# Altium project Sensor_board.PrjPcb
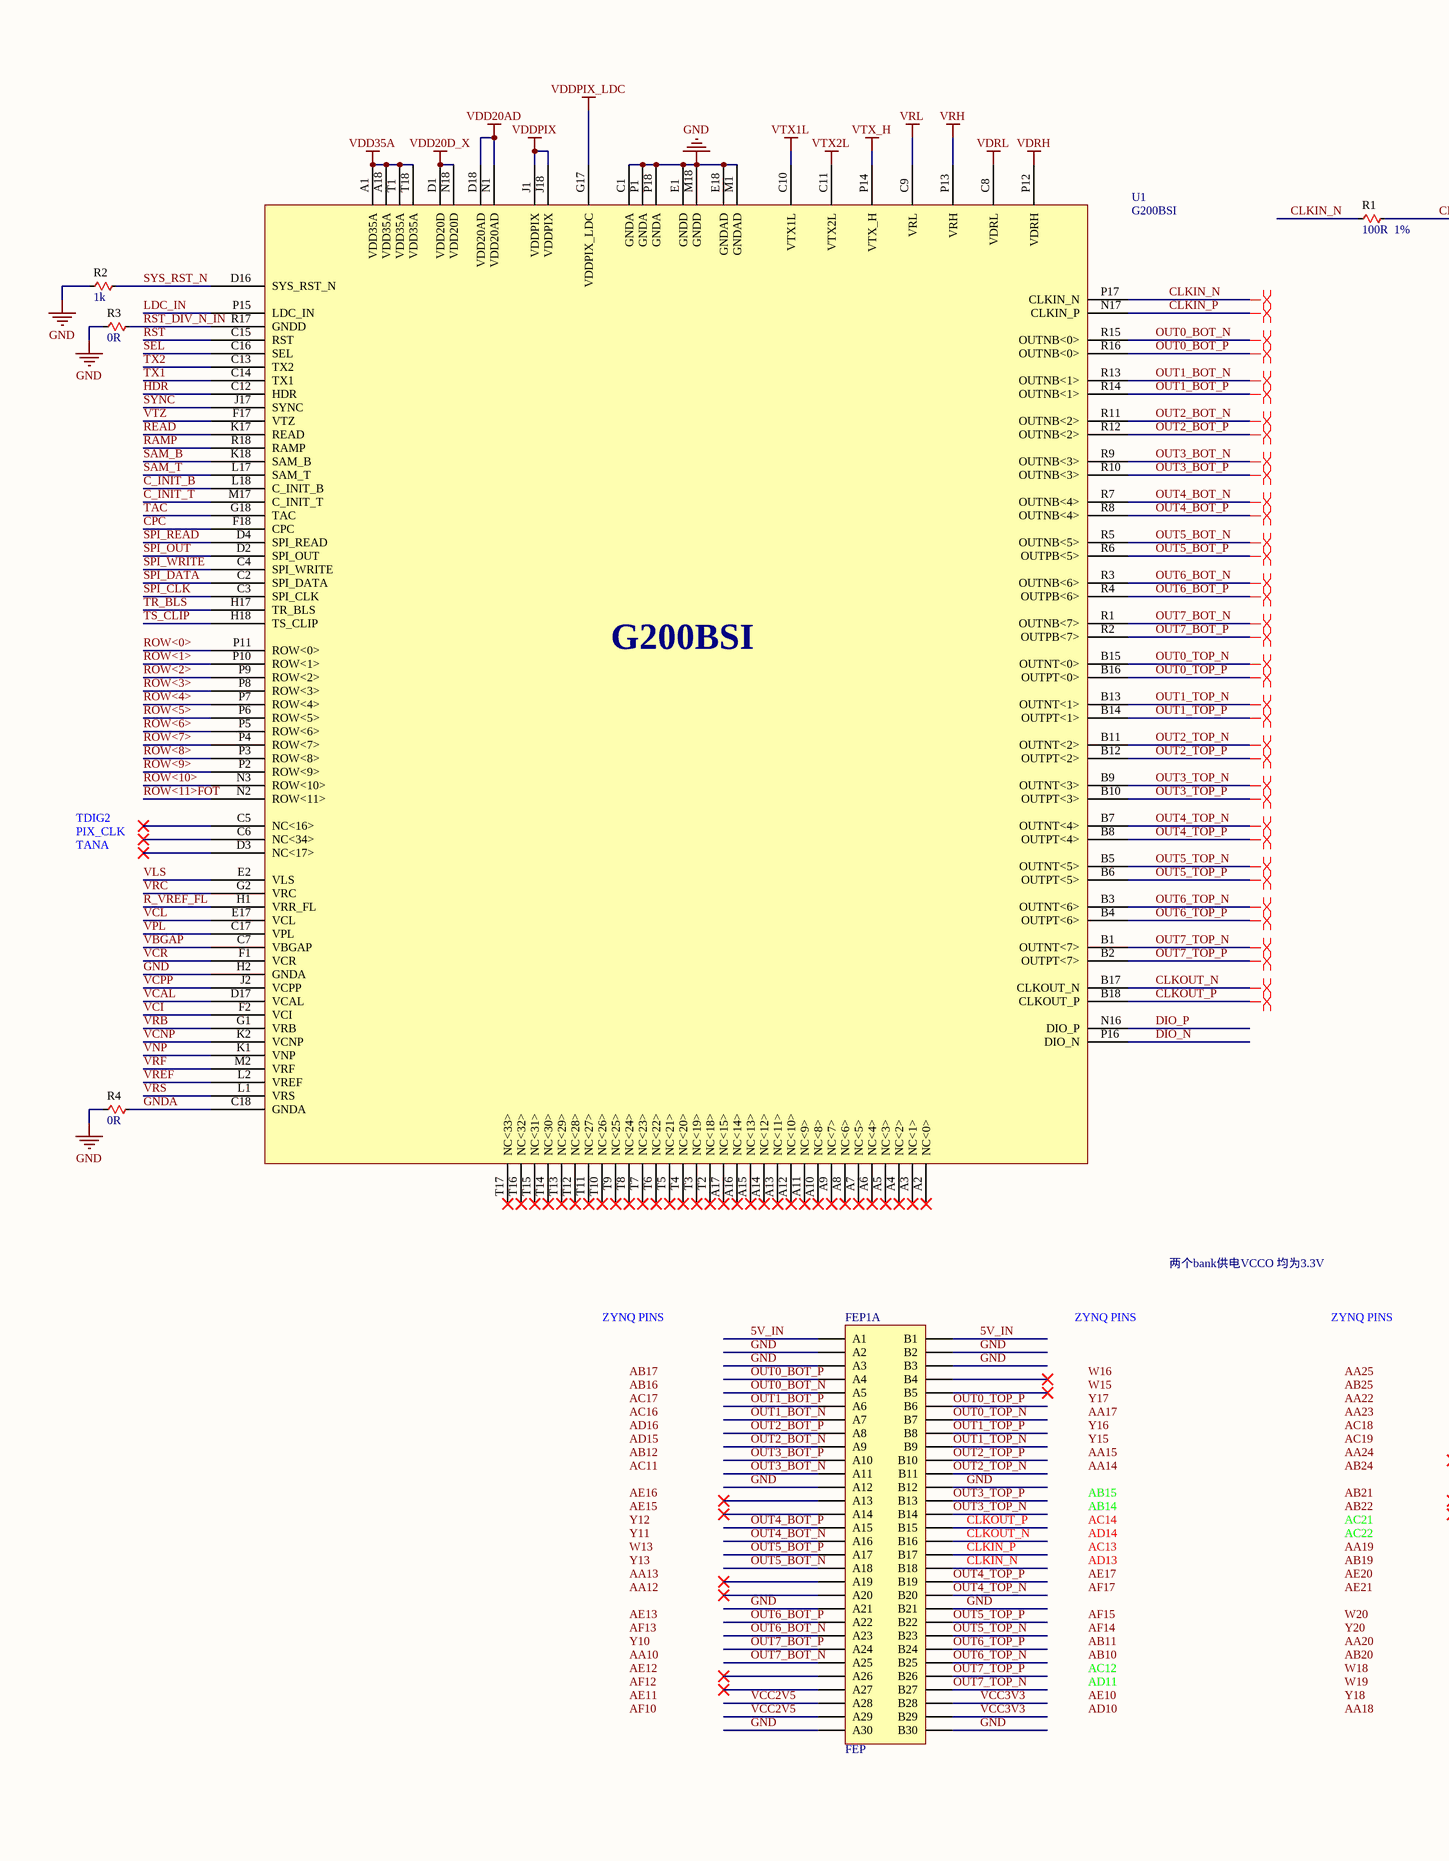
[diagram p0: Sensor.SchDoc, left]
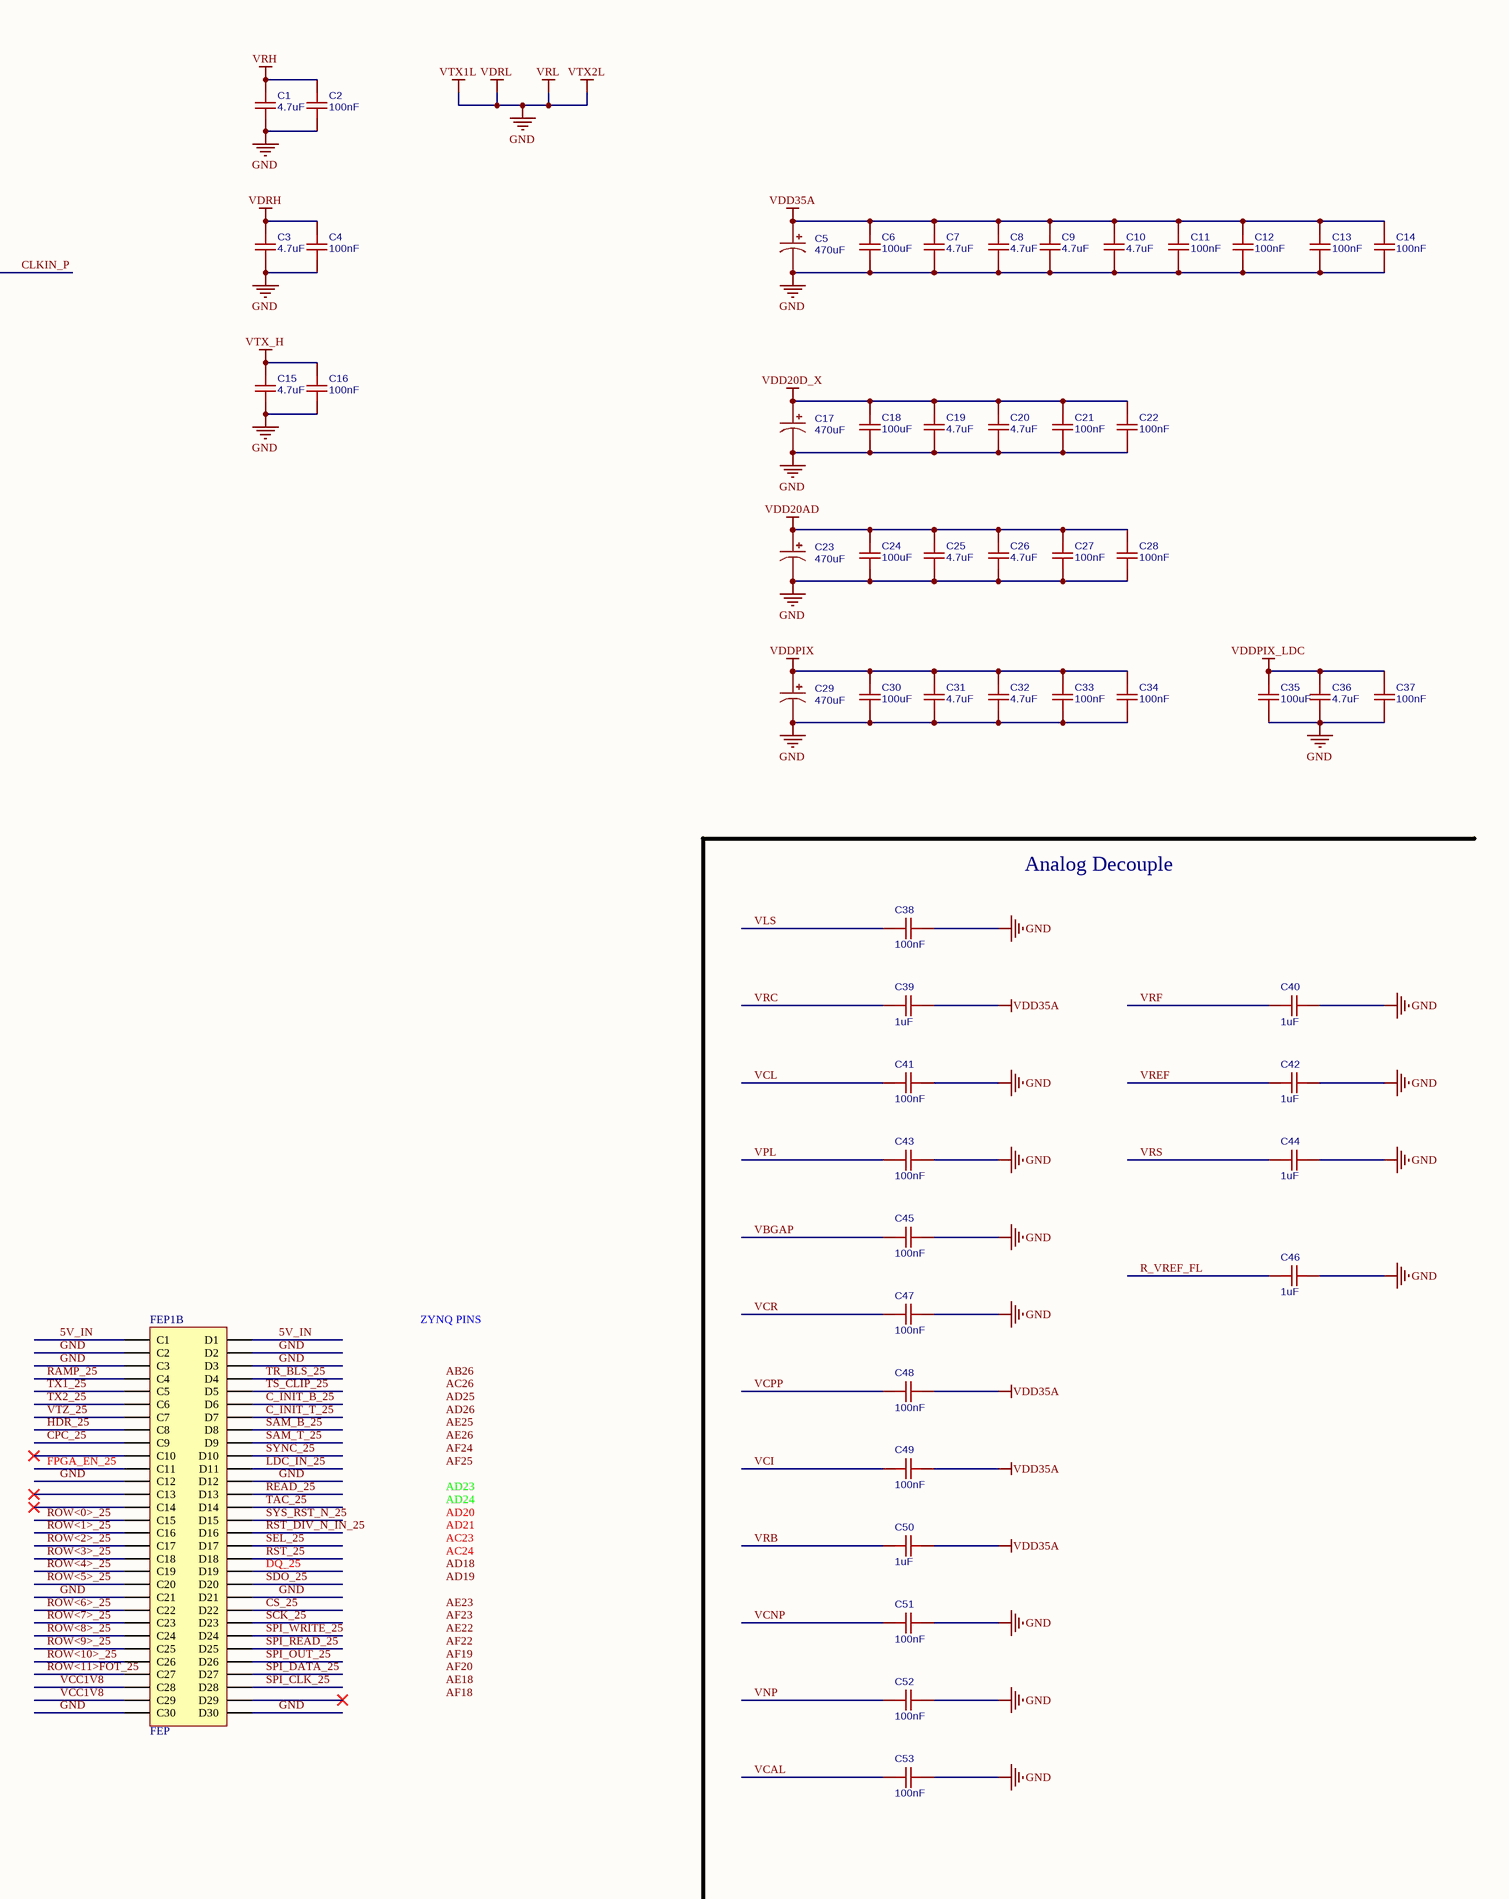
[diagram p1: Sensor.SchDoc, right]
2 sheets, 126 parts. Net scope: global (net labels, ports and power ports of the same name join across sheets).
Board file: sensor.PcbDoc
Sheets:
  Sensor.SchDoc
  Sensor_Power_Supply.SchDoc

## Sheet Sensor.SchDoc
size A2

### Parts
C1  4.7uF  [CAP0402]
C2  100nF  [CAP0402]
C3  4.7uF  [CAP0402]
C4  100nF  [CAP0402]
C5  470uF  [CASE-A_3216]
C6  100uF  [CAP0402]
C7  4.7uF  [CAP0402]
C8  4.7uF  [CAP0402]
C9  4.7uF  [CAP0402]
C10  4.7uF  [CAP0402]
C11  100nF  [CAP0402]
C12  100nF  [CAP0402]
C13  100nF  [CAP0402]
C14  100nF  [CAP0402]
C15  4.7uF  [CAP0402]
C16  100nF  [CAP0402]
C17  470uF  [CASE-A_3216]
C18  100uF  [CAP0402]
C19  4.7uF  [CAP0402]
C20  4.7uF  [CAP0402]
C21  100nF  [CAP0402]
C22  100nF  [CAP0402]
C23  470uF  [CASE-A_3216]
C24  100uF  [CAP0402]
C25  4.7uF  [CAP0402]
C26  4.7uF  [CAP0402]
C27  100nF  [CAP0402]
C28  100nF  [CAP0402]
C29  470uF  [CASE-A_3216]
C30  100uF  [CAP0402]
C31  4.7uF  [CAP0402]
C32  4.7uF  [CAP0402]
C33  100nF  [CAP0402]
C34  100nF  [CAP0402]
C35  100uF  [CAP0402]
C36  4.7uF  [CAP0402]
C37  100nF  [CAP0402]
C38  100nF  [CAP0402]
C39  1uF  [CAP0402]
C40  1uF  [CAP0402]
C41  100nF  [CAP0402]
C42  1uF  [CAP0402]
C43  100nF  [CAP0402]
C44  1uF  [CAP0402]
C45  100nF  [CAP0402]
C46  1uF  [CAP0402]
C47  100nF  [CAP0402]
C48  100nF  [CAP0402]
C49  100nF  [CAP0402]
C50  1uF  [CAP0402]
C51  100nF  [CAP0402]
C52  100nF  [CAP0402]
C53  100nF  [CAP0402]
FEP1  FEP  [FEP-X2]  (parts A,B of 3)
R1  100R  1%  [RES0402]
R2  1k  [RES0402]
R3  0R  [RES0402]
R4  0R  [RES0402]
U1  G200BSI  [ANDON Socket]

### Nets
5V_IN: FEP1.A1 FEP1.B1 FEP1.C1 FEP1.D1
GND: C1.1 C2.1 C3.1 C4.1 C5.2 C6.1 C7.1 C8.1 C9.1 C10.1 C11.1 C12.1 C13.1 C14.1 C15.1 C16.1 C17.2 C18.1 C19.1 C20.1 C21.1 C22.1 C23.2 C24.1 C25.1 C26.1 C27.1 C28.1 C29.2 C30.1 C31.1 C32.1 C33.1 C34.1 C35.1 C36.1 C37.1 C38.2 C40.2 C41.2 C42.2 C43.2 C44.2 C45.2 C46.2 C47.2 C51.2 C52.2 C53.2 FEP1.A2 FEP1.A3 FEP1.A12 FEP1.A21 FEP1.A30 FEP1.B2 FEP1.B3 FEP1.B12 FEP1.B21 FEP1.B30 FEP1.C2 FEP1.C3 FEP1.C12 FEP1.C21 FEP1.C30 FEP1.D2 FEP1.D3 FEP1.D12 FEP1.D21 FEP1.D30 R2.2 R3.2 R4.2 U1.C1(GNDA) U1.C8(VDRL) U1.C9(VRL) U1.C10(VTX1L) U1.C11(VTX2L) U1.E1(GNDD) U1.E18(GNDAD) U1.H2(GNDA) U1.M1(GNDAD) U1.M18(GNDD) U1.P1(GNDA) U1.P18(GNDA)  [also labelled VDRL, VRL, VTX1L, VTX2L]
VCC2V5: FEP1.A28 FEP1.A29
VCC3V3: FEP1.B28 FEP1.B29
VDD20AD: C17.1 C18.2 C19.2 C20.2 C21.2 C22.2 C23.1 C24.2 C25.2 C26.2 C27.2 C28.2 U1.D1(VDD20D) U1.D18(VDD20AD) U1.N1(VDD20AD) U1.N18(VDD20D)  [also labelled VDD20D_X]
VDD35A: C5.1 C6.2 C7.2 C8.2 C9.2 C10.2 C11.2 C12.2 C13.2 C14.2 C29.1 C30.2 C31.2 C32.2 C33.2 C34.2 C39.2 C48.2 C49.2 C50.2 U1.A1(VDD35A) U1.A18(VDD35A) U1.J1(VDDPIX) U1.J18(VDDPIX) U1.T1(VDD35A) U1.T18(VDD35A)  [also labelled VDDPIX]
VDDPIX_LDC: C35.2 C36.2 C37.2 U1.G17(VDDPIX_LDC)
VDRH: C1.2 C2.2 C3.2 C4.2 C15.2 C16.2 U1.P12(VDRH) U1.P13(VRH) U1.P14(VTX_H)  [also labelled VRH, VTX_H]
C_INIT_B: U1.L18(C_INIT_B)
C_INIT_B_25: FEP1.D6
C_INIT_T: U1.M17(C_INIT_T)
C_INIT_T_25: FEP1.D7
CLKIN_N: FEP1.B18 R1.2 U1.P17(CLKIN_N)
CLKIN_P: FEP1.B17 R1.1 U1.N17(CLKIN_P)
CLKOUT_N: FEP1.B16 U1.B17(CLKOUT_N)
CLKOUT_P: FEP1.B15 U1.B18(CLKOUT_P)
CPC: U1.F18(CPC)
CPC_25: FEP1.C9
CS_25: FEP1.D22
DIO_N: U1.P16(DIO_N)
DIO_P: U1.N16(DIO_P)
DQ_25: FEP1.D19
FPGA_EN_25: FEP1.C11
GNDA: R4.1 U1.C18(GNDA)
HDR: U1.C12(HDR)
HDR_25: FEP1.C8
LDC_IN: U1.P15(LDC_IN)
LDC_IN_25: FEP1.D11
OUT0_BOT_N: FEP1.A5 U1.R15(OUTNB<0>)
OUT0_BOT_P: FEP1.A4 U1.R16(OUTNB<0>)
OUT0_TOP_N: FEP1.B7 U1.B15(OUTNT<0>)
OUT0_TOP_P: FEP1.B6 U1.B16(OUTPT<0>)
OUT1_BOT_N: FEP1.A7 U1.R13(OUTNB<1>)
OUT1_BOT_P: FEP1.A6 U1.R14(OUTNB<1>)
OUT1_TOP_N: FEP1.B9 U1.B13(OUTNT<1>)
OUT1_TOP_P: FEP1.B8 U1.B14(OUTPT<1>)
OUT2_BOT_N: FEP1.A9 U1.R11(OUTNB<2>)
OUT2_BOT_P: FEP1.A8 U1.R12(OUTNB<2>)
OUT2_TOP_N: FEP1.B11 U1.B11(OUTNT<2>)
OUT2_TOP_P: FEP1.B10 U1.B12(OUTPT<2>)
OUT3_BOT_N: FEP1.A11 U1.R9(OUTNB<3>)
OUT3_BOT_P: FEP1.A10 U1.R10(OUTNB<3>)
OUT3_TOP_N: FEP1.B14 U1.B9(OUTNT<3>)
OUT3_TOP_P: FEP1.B13 U1.B10(OUTPT<3>)
OUT4_BOT_N: FEP1.A16 U1.R7(OUTNB<4>)
OUT4_BOT_P: FEP1.A15 U1.R8(OUTNB<4>)
OUT4_TOP_N: FEP1.B20 U1.B7(OUTNT<4>)
OUT4_TOP_P: FEP1.B19 U1.B8(OUTPT<4>)
OUT5_BOT_N: FEP1.A18 U1.R5(OUTNB<5>)
OUT5_BOT_P: FEP1.A17 U1.R6(OUTPB<5>)
OUT5_TOP_N: FEP1.B23 U1.B5(OUTNT<5>)
OUT5_TOP_P: FEP1.B22 U1.B6(OUTPT<5>)
OUT6_BOT_N: FEP1.A23 U1.R3(OUTNB<6>)
OUT6_BOT_P: FEP1.A22 U1.R4(OUTPB<6>)
OUT6_TOP_N: FEP1.B25 U1.B3(OUTNT<6>)
OUT6_TOP_P: FEP1.B24 U1.B4(OUTPT<6>)
OUT7_BOT_N: FEP1.A25 U1.R1(OUTNB<7>)
OUT7_BOT_P: FEP1.A24 U1.R2(OUTPB<7>)
OUT7_TOP_N: FEP1.B27 U1.B1(OUTNT<7>)
OUT7_TOP_P: FEP1.B26 U1.B2(OUTPT<7>)
R_VREF_FL: C46.1 U1.H1(VRR_FL)
RAMP: U1.R18(RAMP)
RAMP_25: FEP1.C4
READ: U1.K17(READ)
READ_25: FEP1.D13
ROW<0>: U1.P11(ROW<0>)
ROW<0>_25: FEP1.C15
ROW<1>: U1.P10(ROW<1>)
ROW<1>_25: FEP1.C16
ROW<2>: U1.P9(ROW<2>)
ROW<2>_25: FEP1.C17
ROW<3>: U1.P8(ROW<3>)
ROW<3>_25: FEP1.C18
ROW<4>: U1.P7(ROW<4>)
ROW<4>_25: FEP1.C19
ROW<5>: U1.P6(ROW<5>)
ROW<5>_25: FEP1.C20
ROW<6>: U1.P5(ROW<6>)
ROW<6>_25: FEP1.C22
ROW<7>: U1.P4(ROW<7>)
ROW<7>_25: FEP1.C23
ROW<8>: U1.P3(ROW<8>)
ROW<8>_25: FEP1.C24
ROW<9>: U1.P2(ROW<9>)
ROW<9>_25: FEP1.C25
ROW<10>: U1.N3(ROW<10>)
ROW<10>_25: FEP1.C26
ROW<11>FOT: U1.N2(ROW<11>)
ROW<11>FOT_25: FEP1.C27
RST: U1.C15(RST)
RST_25: FEP1.D18
RST_DIV_N_IN: R3.1 U1.R17(GNDD)
RST_DIV_N_IN_25: FEP1.D16
SAM_B: U1.K18(SAM_B)
SAM_B_25: FEP1.D8
SAM_T: U1.L17(SAM_T)
SAM_T_25: FEP1.D9
SCK_25: FEP1.D23
SDO_25: FEP1.D20
SEL: U1.C16(SEL)
SEL_25: FEP1.D17
SPI_CLK: U1.C3(SPI_CLK)
SPI_CLK_25: FEP1.D28
SPI_DATA: U1.C2(SPI_DATA)
SPI_DATA_25: FEP1.D27
SPI_OUT: U1.D2(SPI_OUT)
SPI_OUT_25: FEP1.D26
SPI_READ: U1.D4(SPI_READ)
SPI_READ_25: FEP1.D25
SPI_WRITE: U1.C4(SPI_WRITE)
SPI_WRITE_25: FEP1.D24
SYNC: U1.J17(SYNC)
SYNC_25: FEP1.D10
SYS_RST_N: R2.1 U1.D16(SYS_RST_N)
SYS_RST_N_25: FEP1.D15
TAC: U1.G18(TAC)
TAC_25: FEP1.D14
TR_BLS: U1.H17(TR_BLS)
TR_BLS_25: FEP1.D4
TS_CLIP: U1.H18(TS_CLIP)
TS_CLIP_25: FEP1.D5
TX1: U1.C14(TX1)
TX1_25: FEP1.C5
TX2: U1.C13(TX2)
TX2_25: FEP1.C6
VBGAP: C45.1 U1.C7(VBGAP)
VCAL: C53.1 U1.D17(VCAL)
VCC1V8: FEP1.C28 FEP1.C29
VCI: C49.1 U1.F2(VCI)
VCL: C41.1 U1.E17(VCL)
VCNP: C51.1 U1.K2(VCNP)
VCPP: C48.1 U1.J2(VCPP)
VCR: C47.1 U1.F1(VCR)
VLS: C38.1 U1.E2(VLS)
VNP: C52.1 U1.K1(VNP)
VPL: C43.1 U1.C17(VPL)
VRB: C50.1 U1.G1(VRB)
VRC: C39.1 U1.G2(VRC)
VREF: C42.1 U1.L2(VREF)
VRF: C40.1 U1.M2(VRF)
VRS: C44.1 U1.L1(VRS)
VTZ: U1.F17(VTZ)
VTZ_25: FEP1.C7

Not connected (* = marked no-connect by the designer): FEP1 A13* A14* A19* A20* A26* A27* B4* B5* C10* C13* C14* D29*; U1 A2(NC<0>)* A3(NC<1>)* A4(NC<2>)* A5(NC<3>)* A6(NC<4>)* A7(NC<5>)* A8(NC<6>)* A9(NC<7>)* A10(NC<8>)* A11(NC<9>)* A12(NC<10>)* A13(NC<11>)* A14(NC<12>)* A15(NC<13>)* A16(NC<14>)* A17(NC<15>)* C5(NC<16>)* C6(NC<34>)* D3(NC<17>)* T2(NC<18>)* T3(NC<19>)* T4(NC<20>)* T5(NC<21>)* T6(NC<22>)* T7(NC<23>)* T8(NC<24>)* T9(NC<25>)* T10(NC<26>)* T11(NC<27>)* T12(NC<28>)* T13(NC<29>)* T14(NC<30>)* T15(NC<31>)* T16(NC<32>)* T17(NC<33>)*

### Layout directives
differential pair: CLKIN_N, CLKIN_P, CLKOUT_N, CLKOUT_P, OUT0_BOT_N, OUT0_BOT_P, OUT0_TOP_N, OUT0_TOP_P, OUT1_BOT_N, OUT1_BOT_P, OUT1_TOP_N, OUT1_TOP_P, OUT2_BOT_N, OUT2_BOT_P, OUT2_TOP_N, OUT2_TOP_P, OUT3_BOT_N, OUT3_BOT_P, OUT3_TOP_N, OUT3_TOP_P, OUT4_BOT_N, OUT4_BOT_P, OUT4_TOP_N, OUT4_TOP_P, OUT5_BOT_N, OUT5_BOT_P, OUT5_TOP_N, OUT5_TOP_P, OUT6_BOT_N, OUT6_BOT_P, OUT6_TOP_N, OUT6_TOP_P, OUT7_BOT_N, OUT7_BOT_P, OUT7_TOP_N, OUT7_TOP_P

### Notes on the sheet
- Analog Decouple
- 两个bank供电VCCO 均为3.3V
- Labels drawn without touching a wire or pin: AA10, AA12, AA13, AA14, AA15, AA17, AA18, AA19, AA20, AA22, AA23, AA24, AA25, AB10, AB11, AB12, AB14, AB15, AB16, AB17, AB19, AB20, AB21, AB22, AB24, AB25, AB26, AC11, AC12, AC13, AC14, AC16, AC17, AC18, AC19, AC21, AC22, AC23, AC24, AC26, AD10, AD11, AD13, AD14, AD15, AD16, AD18, AD19, AD20, AD21, AD23, AD24, AD25, AD26, AE10, AE11, AE12, AE13, AE15, AE16, AE17, AE18, AE20, AE21, AE22, AE23, AE25, AE26, AF10, AF12, AF13, AF14, AF15, AF17, AF18, AF19, AF20, AF22, AF23, AF24, AF25, PIX_CLK, TANA, TDIG2, W13, W15, W16, W18, W19, W20, Y10, Y11, Y12, Y13, Y15, Y16, Y17, Y18, Y20, ZYNQ PINS

### Library data of the parts
C1 C3 C7-C10 C15 C19 C20 C25 C26 C31 C32 C36 = 4.7u: nameAlias: Value(F); Contributor: LCEDA_Lib; spicePre: C; spiceSymbolName: C_0603_US
C2 C4 C6 C11-C14 C16 C18 C21 C22 C24 C27 C28 C30 C33-C35 C37 C38 C41 C43 C45 C47-C49 C51-C53 = 100n: nameAlias: Value(F); Contributor: LCEDA_Lib; spicePre: C; spiceSymbolName: C_0603_US
C5 C17 C23 C29 = 150u: nameAlias: Value(F); Contributor: LCEDA_Lib; spicePre: C; spiceSymbolName: C_Tan_SMD_A_US
C39 C40 C42 C44 C46 C50 = 1u: nameAlias: Value(F); Contributor: LCEDA_Lib; spicePre: C; spiceSymbolName: C_0603_US
FEP1 = FEP-2X
R1-R4 = RESISTOR: Generic Resistor; Value: 10K; Manufacturer: *; DPN: *

## Sheet Sensor_Power_Supply.SchDoc
size A3
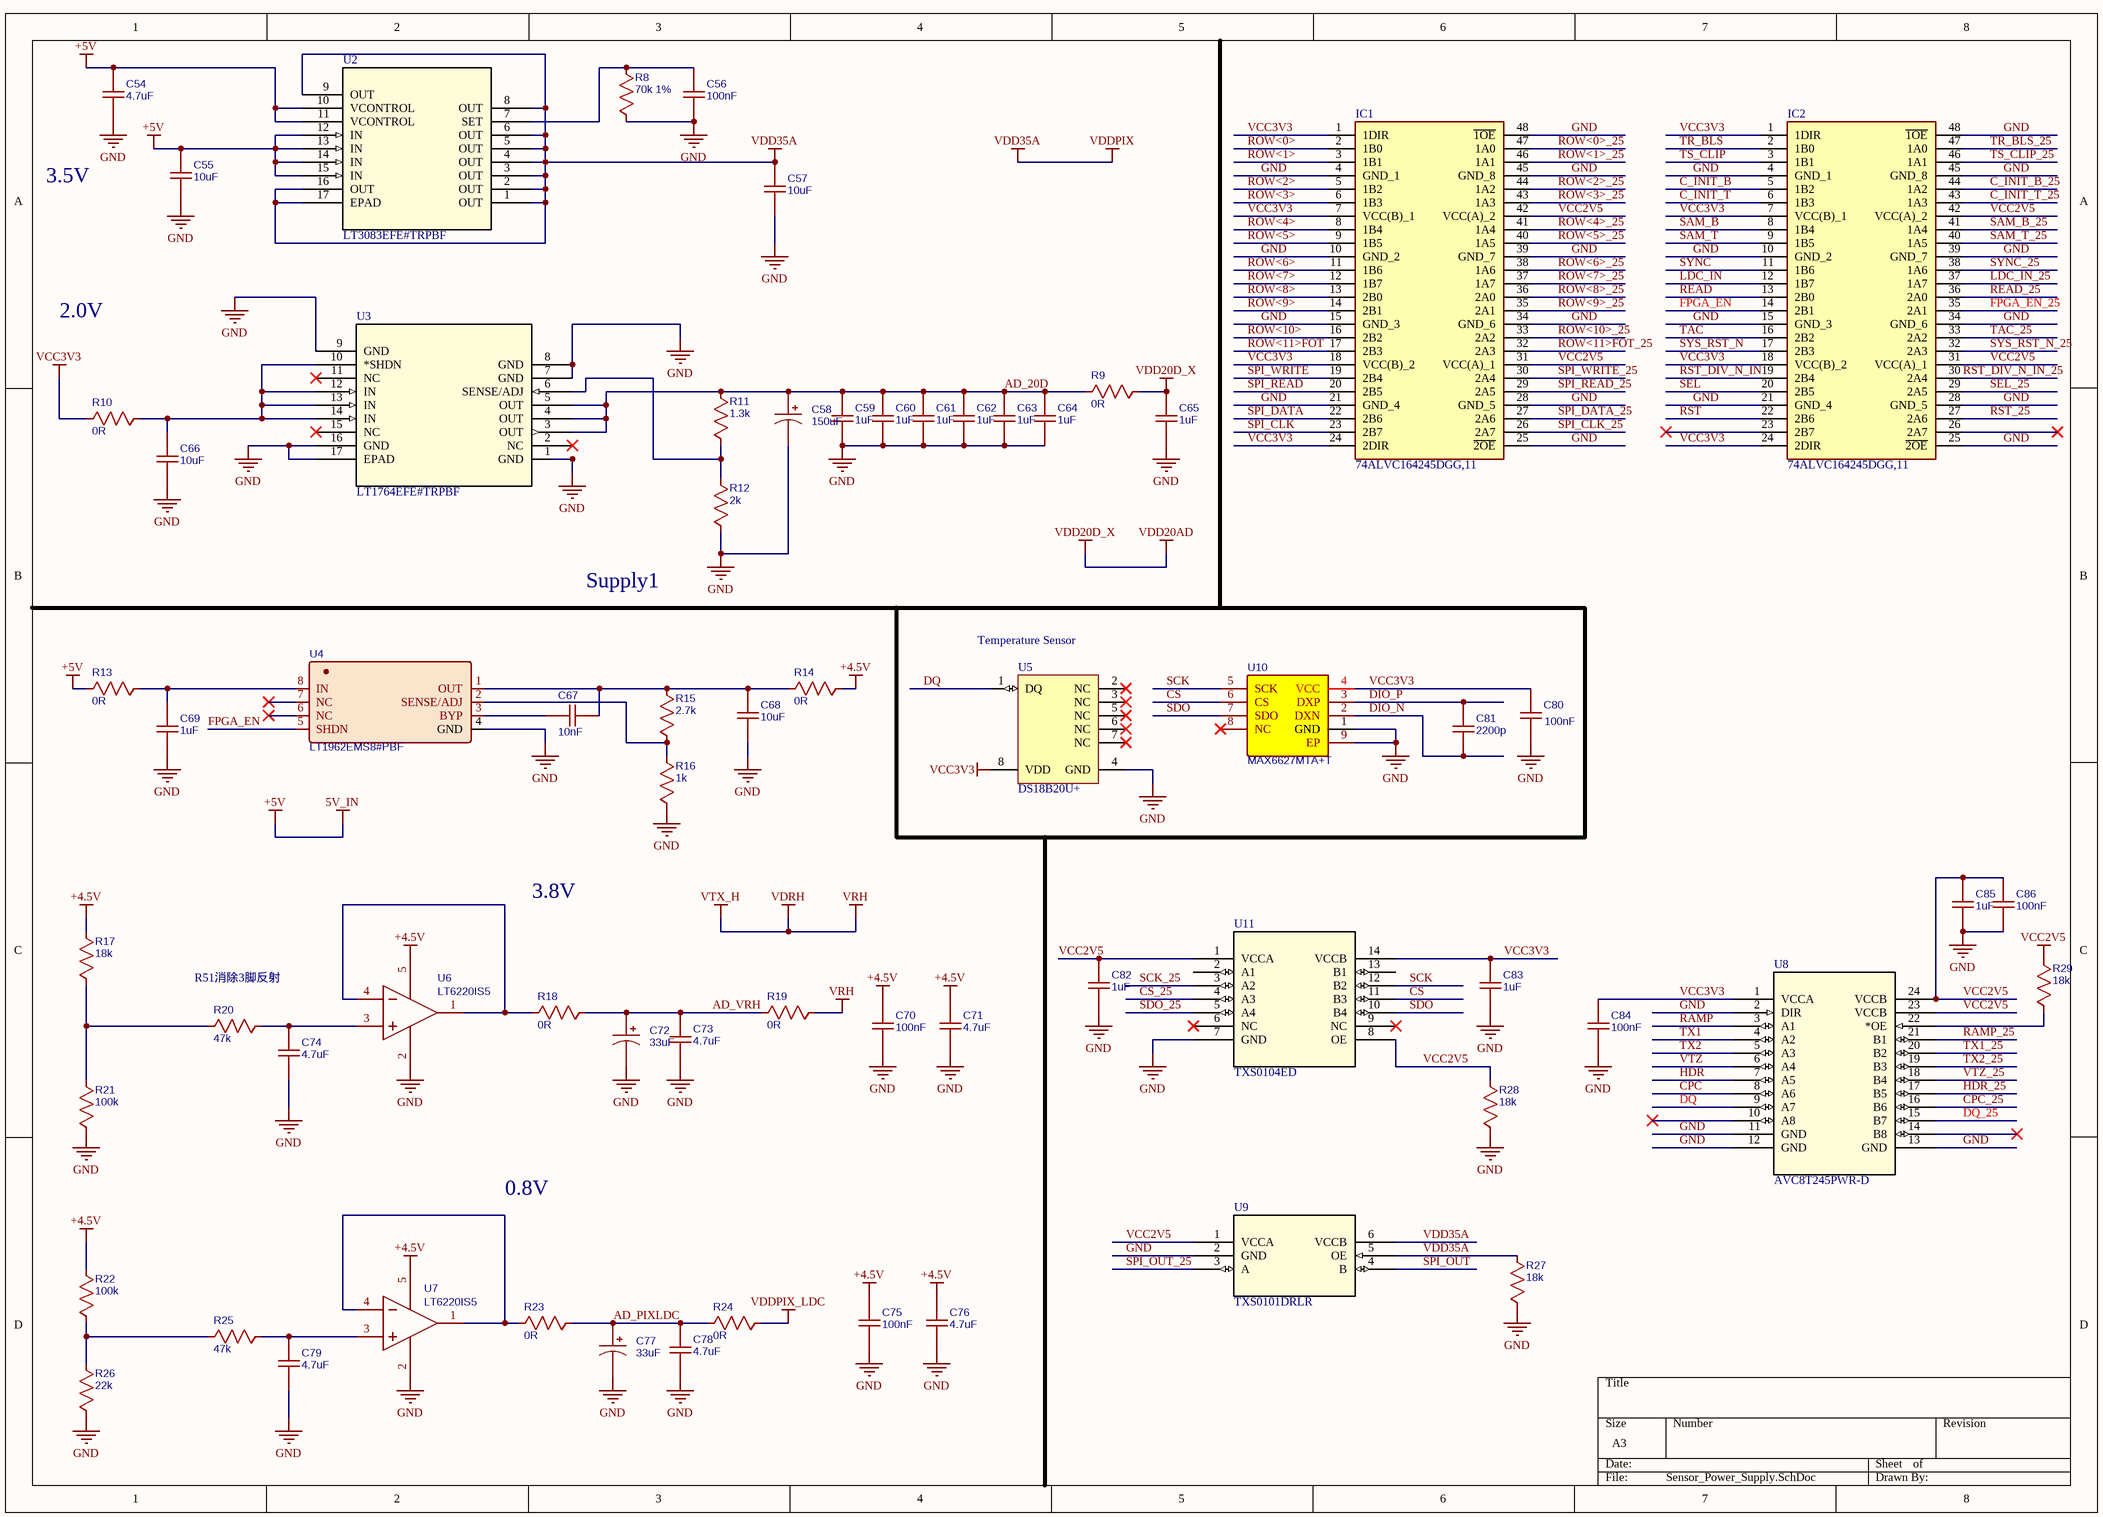
[diagram p2: Sensor_Power_Supply.SchDoc]

### Parts
C54  4.7uF  [C0603]
C55  10uF  [C0603]
C56  100nF  [C0603]
C57  10uF  [CAP0402]
C58  150uF  [CASE-A_3216]
C59  1uF  [C0603]
C60  1uF  [C0603]
C61  1uF  [C0603]
C62  1uF  [C0603]
C63  1uF  [C0603]
C64  1uF  [C0603]
C65  1uF  [C0603]
C66  10uF  [C0603]
C67  10nF  [CAP0402]
C68  10uF  [C0603]
C69  1uF  [C0603]
C70  100nF  [C0603]
C71  4.7uF  [C0603]
C72  33uF  [CASE-A_3216]
C73  4.7uF  [C0603]
C74  4.7uF  [C0603]
C75  100nF  [C0603]
C76  4.7uF  [C0603]
C77  33uF  [CASE-A_3216]
C78  4.7uF  [C0603]
C79  4.7uF  [C0603]
C80  100nF  [C0603]
C81  2200p  [C0603]
C82  1uF  [CAP0402]
C83  1uF  [CAP0402]
C84  100nF  [CAP0402]
C85  1uF  [CAP0402]
C86  100nF  [CAP0402]
IC1  74ALVC164245DGG,11  [SOP50P810X120-48N]
IC2  74ALVC164245DGG,11  [SOP50P810X120-48N]
R8  70k 1%  [R0603]
R9  0R  [R0603]
R10  0R  [R0603]
R11  1.3k  [R0603]
R12  2k  [R0603]
R13  0R  [R0603]
R14  0R  [R0603]
R15  2.7k  [RES0402]
R16  1k  [RES0402]
R17  18k  [R0603]
R18  0R  [RES0402]
R19  0R  [R0603]
R20  47k  [R0603]
R21  100k  [R0603]
R22  100k  [R0603]
R23  0R  [RES0402]
R24  0R  [R0603]
R25  47k  [R0603]
R26  22k  [R0603]
R27  18k  [RES0402]
R28  18k  [R0603]
R29  18k  [RES0402]
U2  LT3083EFE#TRPBF  [TSSOP-16_FE/BB]
U3  LT1764EFE#TRPBF  [TSSOP-16_FE/BB]
U4  LT1962EMS8#PBF  [MSOP-8_L3.0-W3.0-P0.65-LS5.0-TL]
U5  DS18B20U+  [MAXM-U8+1_N]
U6  LT6220IS5  [SOT23-5]
U7  LT6220IS5  [SOT23-5]
U8  AVC8T245PWR-D  [PW24]
U9  TXS0101DRLR  [DRL6]
U10  MAX6627MTA+T  [MAXM-T833+2_V]
U11  TXS0104ED  [D14]

### Nets
5V_IN: C54.2 C55.2 R13.1 U2.10(VCONTROL) U2.11(VCONTROL) U2.12(IN) U2.13(IN) U2.14(IN) U2.15(IN)  [also labelled +5V]
+4.5V: C70.2 C71.2 C75.2 C76.2 R14.2 R17.2 R22.2 U6.5(VS+) U7.5(VS+)
GND: C54.1 C55.1 C56.1 C57.1 C58.2 C59.1 C60.1 C61.1 C62.1 C63.1 C64.1 C65.1 C66.1 C68.2 C69.1 C70.1 C71.1 C72.2 C73.1 C74.1 C75.1 C76.1 C77.2 C78.1 C79.1 C80.1 C82.1 C83.1 C84.1 C85.1 C86.1 IC1.4(GND_1) IC1.10(GND_2) IC1.15(GND_3) IC1.21(GND_4) IC1.25(~{2OE}) IC1.28(GND_5) IC1.34(GND_6) IC1.39(GND_7) IC1.45(GND_8) IC1.48(~{1OE}) IC2.4(GND_1) IC2.10(GND_2) IC2.15(GND_3) IC2.21(GND_4) IC2.25(~{2OE}) IC2.28(GND_5) IC2.34(GND_6) IC2.39(GND_7) IC2.45(GND_8) IC2.48(~{1OE}) R8.1 R12.1 R16.1 R21.1 R26.1 R27.1 R28.1 U3.1(GND) U3.7(GND) U3.8(GND) U3.9(GND) U3.16(GND) U3.17(EPAD) U4.4(GND) U5.4(GND) U6.2(VS-) U7.2(VS-) U8.2(DIR) U8.11(GND) U8.12(GND) U8.13(GND) U9.2(GND) U10.1(GND) U10.9(EP) U11.7(GND)
VCC2V5: C82.2 C85.2 C86.2 IC1.31(VCC(A)_1) IC1.42(VCC(A)_2) IC2.31(VCC(A)_1) IC2.42(VCC(A)_2) R28.2 R29.2 U8.23(VCCB) U8.24(VCCB) U9.1(VCCA) U11.1(VCCA) U11.8(OE)
VCC3V3: C80.2 C83.2 C84.2 IC1.1(1DIR) IC1.7(VCC(B)_1) IC1.18(VCC(B)_2) IC1.24(2DIR) IC2.1(1DIR) IC2.7(VCC(B)_1) IC2.18(VCC(B)_2) IC2.24(2DIR) R10.1 U5.8(VDD) U8.1(VCCA) U10.4(VCC) U11.14(VCCB)
VDD20AD: C65.2 R9.2  [also labelled VDD20D_X]
VDD35A: C57.2 R27.2 U2.1(OUT) U2.2(OUT) U2.3(OUT) U2.4(OUT) U2.5(OUT) U2.6(OUT) U2.8(OUT) U2.9(OUT) U2.16(OUT) U2.17(EPAD) U9.5(OE) U9.6(VCCB)  [also labelled VDDPIX]
VDDPIX_LDC: R24.2
VDRH: R19.2  [also labelled VRH, VTX_H]
AD_20D: C58.1 C59.2 C60.2 C61.2 C62.2 C63.2 C64.2 R9.1 R11.2 U3.3(OUT) U3.4(OUT) U3.5(OUT)
AD_PIXLDC: C77.1 C78.2 R23.2 R24.1
AD_VRH: C72.1 C73.2 R18.2 R19.1
C_INIT_B: IC2.5(1B2)
C_INIT_B_25: IC2.44(1A2)
C_INIT_T: IC2.6(1B3)
C_INIT_T_25: IC2.43(1A3)
CPC: U8.8(A6)
CPC_25: U8.16(B6)
CS: U10.6(CS) U11.11(B3)
CS_25: U11.4(A3)
DIO_N: C81.1 U10.2(DXN)
DIO_P: C81.2 U10.3(DXP)
DQ: U5.1(DQ) U8.9(A7)
DQ_25: U8.15(B7)
FPGA_EN: IC2.14(2B1) U4.5(SHDN)
FPGA_EN_25: IC2.35(2A1)
HDR: U8.7(A5)
HDR_25: U8.17(B5)
LDC_IN: IC2.12(1B7)
LDC_IN_25: IC2.37(1A7)
RAMP: U8.3(A1)
RAMP_25: U8.21(B1)
READ: IC2.13(2B0)
READ_25: IC2.36(2A0)
ROW<0>: IC1.2(1B0)
ROW<0>_25: IC1.47(1A0)
ROW<1>: IC1.3(1B1)
ROW<1>_25: IC1.46(1A1)
ROW<2>: IC1.5(1B2)
ROW<2>_25: IC1.44(1A2)
ROW<3>: IC1.6(1B3)
ROW<3>_25: IC1.43(1A3)
ROW<4>: IC1.8(1B4)
ROW<4>_25: IC1.41(1A4)
ROW<5>: IC1.9(1B5)
ROW<5>_25: IC1.40(1A5)
ROW<6>: IC1.11(1B6)
ROW<6>_25: IC1.38(1A6)
ROW<7>: IC1.12(1B7)
ROW<7>_25: IC1.37(1A7)
ROW<8>: IC1.13(2B0)
ROW<8>_25: IC1.36(2A0)
ROW<9>: IC1.14(2B1)
ROW<9>_25: IC1.35(2A1)
ROW<10>: IC1.16(2B2)
ROW<10>_25: IC1.33(2A2)
ROW<11>FOT: IC1.17(2B3)
ROW<11>FOT_25: IC1.32(2A3)
RST: IC2.22(2B6)
RST_25: IC2.27(2A6)
RST_DIV_N_IN: IC2.19(2B4)
RST_DIV_N_IN_25: IC2.30(2A4)
SAM_B: IC2.8(1B4)
SAM_B_25: IC2.41(1A4)
SAM_T: IC2.9(1B5)
SAM_T_25: IC2.40(1A5)
SCK: U10.5(SCK) U11.12(B2)
SCK_25: U11.3(A2)
SDO: U10.7(SDO) U11.10(B4)
SDO_25: U11.5(A4)
SEL: IC2.20(2B5)
SEL_25: IC2.29(2A5)
SPI_CLK: IC1.23(2B7)
SPI_CLK_25: IC1.26(2A7)
SPI_DATA: IC1.22(2B6)
SPI_DATA_25: IC1.27(2A6)
SPI_OUT: U9.4(B)
SPI_OUT_25: U9.3(A)
SPI_READ: IC1.20(2B5)
SPI_READ_25: IC1.29(2A5)
SPI_WRITE: IC1.19(2B4)
SPI_WRITE_25: IC1.30(2A4)
SYNC: IC2.11(1B6)
SYNC_25: IC2.38(1A6)
SYS_RST_N: IC2.17(2B3)
SYS_RST_N_25: IC2.32(2A3)
TAC: IC2.16(2B2)
TAC_25: IC2.33(2A2)
TR_BLS: IC2.2(1B0)
TR_BLS_25: IC2.47(1A0)
TS_CLIP: IC2.3(1B1)
TS_CLIP_25: IC2.46(1A1)
TX1: U8.4(A2)
TX1_25: U8.20(B2)
TX2: U8.5(A3)
TX2_25: U8.19(B3)
VTZ: U8.6(A4)
VTZ_25: U8.18(B4)
NetC56_2: C56.2 R8.2 U2.7(SET)
NetC66_2: C66.2 R10.2 U3.10(*SHDN) U3.12(IN) U3.13(IN) U3.14(IN)
NetC67_1: C67.1 C68.1 R14.1 R15.2 U4.1(OUT)
NetC67_2: C67.2 U4.3(BYP)
NetC69_2: C69.2 R13.2 U4.8(IN)
NetC74_2: C74.2 R20.2 U6.3(+IN)
NetC79_2: C79.2 R25.2 U7.3(+IN)
NetR11_1: R11.1 R12.2 U3.6(SENSE/ADJ)
NetR15_1: R15.1 R16.2 U4.2(SENSE/ADJ)
NetR17_1: R17.1 R20.1 R21.2
NetR18_1: R18.1 U6.1(VOUT) U6.4(-IN)
NetR22_1: R22.1 R25.1 R26.2
NetR23_1: R23.1 U7.1(VOUT) U7.4(-IN)
NetR29_1: R29.1 U8.22(*OE)

Not connected (* = marked no-connect by the designer): IC2 23(2B7)* 26(2A7)*; U3 2(NC)* 11(NC)* 15(NC)*; U4 6(NC)* 7(NC)*; U5 2(NC)* 3(NC)* 5(NC)* 6(NC)* 7(NC)*; U8 10(A8)* 14(B8)*; U10 8(NC)*; U11 2(A1) 6(NC)* 9(NC)* 13(B1)

### Notes on the sheet
- 3.5V
- 2.0V
- Supply1
- (near U5) Temperature Sensor
- 3.8V
- (near R20) R51消除3脚反射
- 0.8V

### Library data of the parts
C54-C57 C66 C68 = 10u: nameAlias: Value(F); Contributor: LCEDA_Lib; spicePre: C; spiceSymbolName: C_0603_US
C58 = 150u: as C5 on sheet Sensor; spicePre: C; spiceSymbolName: C_Tan_SMD_A_US
C59-C65 C69 C82-C86 = 1u: as C39 on sheet Sensor; spicePre: C; spiceSymbolName: C_0603_US
C67 = 10n: nameAlias: Value(F); Contributor: LCEDA_Lib; spicePre: C; spiceSymbolName: C_0603_US
C70 C75 C80 = 100n: as C2 on sheet Sensor; spicePre: C; spiceSymbolName: C_0603_US
C71 C73 C74 C76 C78 C79 = 4.7u: as C1 on sheet Sensor; spicePre: C; spiceSymbolName: C_0603_US
C72 C77 = 33u: nameAlias: Value(F); Contributor: LCEDA_Lib; spicePre: C; spiceSymbolName: C_Tan_SMD_A_US
C81 = 2200p: nameAlias: Value(F); Contributor: LCEDA_Lib; spicePre: C; spiceSymbolName: C_0603_US
IC1 IC2 = 74ALVC164245DGG,11: Integrated Circuit; Manufacturer_Name: Nexperia; Datasheet Link: https://assets.nexperia.com/documents/data-sheet/74ALVC164245.pdf; Height: 1.2mm; Manufacturer_Part_Number: 74ALVC164245DGG,11; Mouser Part Number: 771-74ALVC16424; Mouser Price/Stock: https://www.mouser.co.uk/ProductDetail/Nexperia/74ALVC164245DGG11/?qs=odJ8N4Y39o7U7wQRxrnAkg%3D%3D; Arrow Part Number: 74ALVC164245DGG,11; Arrow Price/Stock: https://www.arrow.com/en/products/74alvc164245dgg11/nexperia
R8-R10 R13 R14 R18 R19 R23 R24 = 0R: nameAlias: Value(Ω); Contributor: LCEDA_Lib; spicePre: R; spiceSymbolName: R_0603_US
R11 R12 R15 = 1k: nameAlias: Value(Ω); Contributor: LCEDA_Lib; spicePre: R; spiceSymbolName: R_0603_US
R16 = 2.7k: nameAlias: Value(Ω); Contributor: LCEDA_Lib; spicePre: R; spiceSymbolName: R_0603_US
R17 = 22k: nameAlias: Value(Ω); Contributor: LCEDA_Lib; spicePre: R; spiceSymbolName: R_0603_US
R20 R22 R25 R26 = 47k: nameAlias: Value(Ω); Contributor: LCEDA_Lib; spicePre: R; spiceSymbolName: R_0603_US
R21 = 100k: nameAlias: Value(Ω); Contributor: LCEDA_Lib; spicePre: R; spiceSymbolName: R_0603_US
R27-R29 = 18k: nameAlias: Value(Ω); Contributor: LCEDA_Lib; spicePre: R; spiceSymbolName: R_0603_US
U2 = LT3083EFE#TRPBF: LDO for 3V5; Vendor: Linear Technology; Manufacturer_Part_Number: lt3083efe#trpbf; Copyright: Copyright (C) 2018 Accelerated Designs. All rights reserved; RefDes: RefDes; Type: DEV
U3 = LT1764EFE#TRPBF: LDO for 2V; Vendor: Linear Technology; Manufacturer_Part_Number: lt1764efe#trpbf; Copyright: Copyright (C) 2018 Accelerated Designs. All rights reserved; RefDes: RefDes; Type: DEV
U4 = LT1962EMS8#PBF: BOM_Manufacturer: Linear Tech; Contributor: LCSC; SMT Type: Extend; BOM_Supplier: LCSC; BOM_Supplier Part: C136801; BOM_Manufacturer Part: LT1962EMS8#PBF; BOM_JLCPCB SMD: Yes; spicePre: U; spiceSymbolName: LT1962EMS8#PBF
U5 = DS18B20U+: High-Precision 1-Wire Digital Thermometer, -55 to 125 degC, 8-Pin SOP (U8+1), Pb-Free; Sensor Type: Local; Multi Droppable: Yes; Temp. Thresh.: Programmable (NV); ComponentLink1Description: Manufacturer URL; ComponentLink2Description: Datasheet; DatasheetVersion: Rev. 4; Generic Part Number: DS18B20; ComponentLink3URL: http://pdfserv.maximintegrated.com/package_dwgs/21-0036.PDF; ComponentLink3Description: Package Specification; ComponentLink1URL: http://www.maximintegrated.com/; ComponentLink2URL: http://datasheets.maximintegrated.com/en/ds/DS18B20.pdf; Code_JEDEC: MO-187; PackageVersion: Rev. L, 08/2009; Parasite Pwr.: Yes; Interface: 1-Wire; PartNumber: DS18B20U+; PackageDescription: 8-Pin Micro-MAX, Thin Shrink Small-Outline (U8+1), Body 3 x 3 mm, Pitch 0.65 mm; Mounting Technology: Surface Mount; RoHS: Pb-Free; PackageReference: U8+1
U8 = AVC8T245PWR-D: 8-Bit Dual-Supply Bus Transceiver with Configurable Voltage Translation and 3-State Outputs; Manufacturer: Texas Instruments; GENERIC_PART_NUMBER: SN74AVC8T245; INDUSTRY_STD_PKG_TYPE: TSSOP; FAMILY_NAME: DIRECTION CONTROL DUAL SUPPLY TRANSLATOR; PIN_COUNT: 24; PACKAGE_DESIGNATOR: PW; Datasheet_URL: http://www.ti.com/lit/gpn/SN74AVC8T245; Vendor: Texas Instruments; Manufacturer_Part_Number: AVC8T245PWR-D; Copyright: Copyright (C) 2018 Accelerated Designs. All rights reserved; RefDes: RefDes; Type: DEV
U9 = TXS0101DRLR: 1-Bit Bidirectional Voltage-Level Translator for Open-Drain Application; Vendor: Texas Instruments; PACKAGE_DESIGNATOR: DRL; PIN_COUNT: 6; FAMILY_NAME: AUTO DIRECTION SENSING DUAL SUPPLY TRANSLATOR; INDUSTRY_STD_PKG_TYPE: SOT; Manufacturer_Part_Number: TXS0101DRLR; GENERIC_PART_NUMBER: TXS0101; Datasheet_URL: http://www.ti.com/lit/gpn/TXS0101; Manufacturer: Texas Instruments; Copyright: Copyright (C) 2018 Accelerated Designs. All rights reserved; RefDes: RefDes; Type: DEV
U11 = TXS0104ED: 4-Bit Bidirectional Voltage-Level Translator for Open-Drain Applications; Vendor: Texas Instruments; PACKAGE_DESIGNATOR: D; PIN_COUNT: 14; FAMILY_NAME: AUTO DIRECTION SENSING DUAL SUPPLY TRANSLATOR; INDUSTRY_STD_PKG_TYPE: SOIC; Manufacturer_Part_Number: TXS0104ED; GENERIC_PART_NUMBER: TXS0104E; Datasheet_URL: http://www.ti.com/lit/gpn/TXS0104E; Manufacturer: Texas Instruments; Copyright: Copyright (C) 2018 Accelerated Designs. All rights reserved; RefDes: RefDes; Type: DEV
U6 U7 = LT6220IS5: spicePre: U; spiceSymbolName: LT6220IS5
U10 = MAX6627MTA+T: spicePre: U; spiceSymbolName: MAX6627MTA+T

## Nets that join several sheets
5V_IN: Sensor (FEP1.A1 FEP1.B1 FEP1.C1 FEP1.D1), Sensor_Power_Supply (9 pins)
GND: Sensor (84 pins), Sensor_Power_Supply (76 pins)
VCC2V5: Sensor (FEP1.A28 FEP1.A29), Sensor_Power_Supply (14 pins)
VCC3V3: Sensor (FEP1.B28 FEP1.B29), Sensor_Power_Supply (16 pins)
VDD20AD: Sensor (16 pins), Sensor_Power_Supply (C65.2 R9.2)
VDD35A: Sensor (26 pins), Sensor_Power_Supply (14 pins)
VDDPIX_LDC: Sensor (C35.2 C36.2 C37.2 U1.G17), Sensor_Power_Supply (R24.2)
VDRH: Sensor (9 pins), Sensor_Power_Supply (R19.2)
C_INIT_B: Sensor (U1.L18), Sensor_Power_Supply (IC2.5)
C_INIT_B_25: Sensor (FEP1.D6), Sensor_Power_Supply (IC2.44)
C_INIT_T: Sensor (U1.M17), Sensor_Power_Supply (IC2.6)
C_INIT_T_25: Sensor (FEP1.D7), Sensor_Power_Supply (IC2.43)
CPC: Sensor (U1.F18), Sensor_Power_Supply (U8.8)
CPC_25: Sensor (FEP1.C9), Sensor_Power_Supply (U8.16)
CS_25: Sensor (FEP1.D22), Sensor_Power_Supply (U11.4)
DIO_N: Sensor (U1.P16), Sensor_Power_Supply (C81.1 U10.2)
DIO_P: Sensor (U1.N16), Sensor_Power_Supply (C81.2 U10.3)
DQ_25: Sensor (FEP1.D19), Sensor_Power_Supply (U8.15)
FPGA_EN_25: Sensor (FEP1.C11), Sensor_Power_Supply (IC2.35)
HDR: Sensor (U1.C12), Sensor_Power_Supply (U8.7)
HDR_25: Sensor (FEP1.C8), Sensor_Power_Supply (U8.17)
LDC_IN: Sensor (U1.P15), Sensor_Power_Supply (IC2.12)
LDC_IN_25: Sensor (FEP1.D11), Sensor_Power_Supply (IC2.37)
RAMP: Sensor (U1.R18), Sensor_Power_Supply (U8.3)
RAMP_25: Sensor (FEP1.C4), Sensor_Power_Supply (U8.21)
READ: Sensor (U1.K17), Sensor_Power_Supply (IC2.13)
READ_25: Sensor (FEP1.D13), Sensor_Power_Supply (IC2.36)
ROW<0>: Sensor (U1.P11), Sensor_Power_Supply (IC1.2)
ROW<0>_25: Sensor (FEP1.C15), Sensor_Power_Supply (IC1.47)
ROW<1>: Sensor (U1.P10), Sensor_Power_Supply (IC1.3)
ROW<1>_25: Sensor (FEP1.C16), Sensor_Power_Supply (IC1.46)
ROW<2>: Sensor (U1.P9), Sensor_Power_Supply (IC1.5)
ROW<2>_25: Sensor (FEP1.C17), Sensor_Power_Supply (IC1.44)
ROW<3>: Sensor (U1.P8), Sensor_Power_Supply (IC1.6)
ROW<3>_25: Sensor (FEP1.C18), Sensor_Power_Supply (IC1.43)
ROW<4>: Sensor (U1.P7), Sensor_Power_Supply (IC1.8)
ROW<4>_25: Sensor (FEP1.C19), Sensor_Power_Supply (IC1.41)
ROW<5>: Sensor (U1.P6), Sensor_Power_Supply (IC1.9)
ROW<5>_25: Sensor (FEP1.C20), Sensor_Power_Supply (IC1.40)
ROW<6>: Sensor (U1.P5), Sensor_Power_Supply (IC1.11)
ROW<6>_25: Sensor (FEP1.C22), Sensor_Power_Supply (IC1.38)
ROW<7>: Sensor (U1.P4), Sensor_Power_Supply (IC1.12)
ROW<7>_25: Sensor (FEP1.C23), Sensor_Power_Supply (IC1.37)
ROW<8>: Sensor (U1.P3), Sensor_Power_Supply (IC1.13)
ROW<8>_25: Sensor (FEP1.C24), Sensor_Power_Supply (IC1.36)
ROW<9>: Sensor (U1.P2), Sensor_Power_Supply (IC1.14)
ROW<9>_25: Sensor (FEP1.C25), Sensor_Power_Supply (IC1.35)
ROW<10>: Sensor (U1.N3), Sensor_Power_Supply (IC1.16)
ROW<10>_25: Sensor (FEP1.C26), Sensor_Power_Supply (IC1.33)
ROW<11>FOT: Sensor (U1.N2), Sensor_Power_Supply (IC1.17)
ROW<11>FOT_25: Sensor (FEP1.C27), Sensor_Power_Supply (IC1.32)
RST: Sensor (U1.C15), Sensor_Power_Supply (IC2.22)
RST_25: Sensor (FEP1.D18), Sensor_Power_Supply (IC2.27)
RST_DIV_N_IN: Sensor (R3.1 U1.R17), Sensor_Power_Supply (IC2.19)
RST_DIV_N_IN_25: Sensor (FEP1.D16), Sensor_Power_Supply (IC2.30)
SAM_B: Sensor (U1.K18), Sensor_Power_Supply (IC2.8)
SAM_B_25: Sensor (FEP1.D8), Sensor_Power_Supply (IC2.41)
SAM_T: Sensor (U1.L17), Sensor_Power_Supply (IC2.9)
SAM_T_25: Sensor (FEP1.D9), Sensor_Power_Supply (IC2.40)
SCK_25: Sensor (FEP1.D23), Sensor_Power_Supply (U11.3)
SDO_25: Sensor (FEP1.D20), Sensor_Power_Supply (U11.5)
SEL: Sensor (U1.C16), Sensor_Power_Supply (IC2.20)
SEL_25: Sensor (FEP1.D17), Sensor_Power_Supply (IC2.29)
SPI_CLK: Sensor (U1.C3), Sensor_Power_Supply (IC1.23)
SPI_CLK_25: Sensor (FEP1.D28), Sensor_Power_Supply (IC1.26)
SPI_DATA: Sensor (U1.C2), Sensor_Power_Supply (IC1.22)
SPI_DATA_25: Sensor (FEP1.D27), Sensor_Power_Supply (IC1.27)
SPI_OUT: Sensor (U1.D2), Sensor_Power_Supply (U9.4)
SPI_OUT_25: Sensor (FEP1.D26), Sensor_Power_Supply (U9.3)
SPI_READ: Sensor (U1.D4), Sensor_Power_Supply (IC1.20)
SPI_READ_25: Sensor (FEP1.D25), Sensor_Power_Supply (IC1.29)
SPI_WRITE: Sensor (U1.C4), Sensor_Power_Supply (IC1.19)
SPI_WRITE_25: Sensor (FEP1.D24), Sensor_Power_Supply (IC1.30)
SYNC: Sensor (U1.J17), Sensor_Power_Supply (IC2.11)
SYNC_25: Sensor (FEP1.D10), Sensor_Power_Supply (IC2.38)
SYS_RST_N: Sensor (R2.1 U1.D16), Sensor_Power_Supply (IC2.17)
SYS_RST_N_25: Sensor (FEP1.D15), Sensor_Power_Supply (IC2.32)
TAC: Sensor (U1.G18), Sensor_Power_Supply (IC2.16)
TAC_25: Sensor (FEP1.D14), Sensor_Power_Supply (IC2.33)
TR_BLS: Sensor (U1.H17), Sensor_Power_Supply (IC2.2)
TR_BLS_25: Sensor (FEP1.D4), Sensor_Power_Supply (IC2.47)
TS_CLIP: Sensor (U1.H18), Sensor_Power_Supply (IC2.3)
TS_CLIP_25: Sensor (FEP1.D5), Sensor_Power_Supply (IC2.46)
TX1: Sensor (U1.C14), Sensor_Power_Supply (U8.4)
TX1_25: Sensor (FEP1.C5), Sensor_Power_Supply (U8.20)
TX2: Sensor (U1.C13), Sensor_Power_Supply (U8.5)
TX2_25: Sensor (FEP1.C6), Sensor_Power_Supply (U8.19)
VTZ: Sensor (U1.F17), Sensor_Power_Supply (U8.6)
VTZ_25: Sensor (FEP1.C7), Sensor_Power_Supply (U8.18)